# Altium project 300mGal.PrjPcb
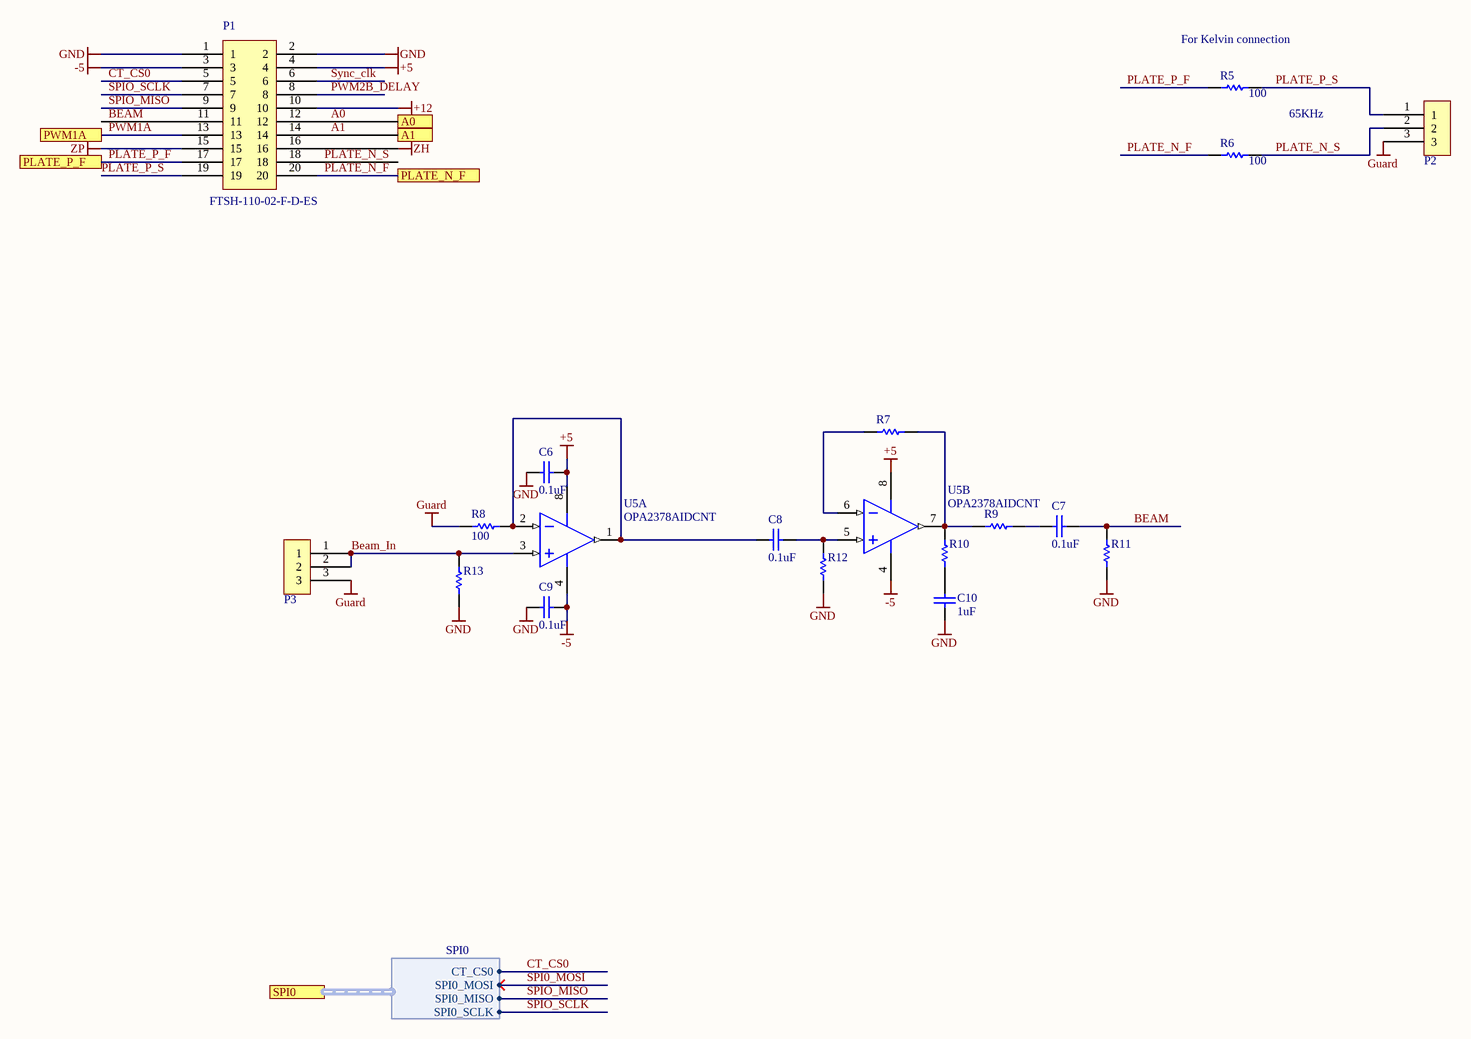
[diagram p0: Beam_Amp.SchDoc]
3 sheets, 41 parts. Net scope: flat (ports and power ports of the same name join across sheets).
Board file: LM-CT-001.PcbDoc
Sheets:
  Beam_Amp.SchDoc
  ZP_Force_Plates.SchDoc
  ADC.SchDoc

## Sheet Beam_Amp.SchDoc
size Tabloid

### Parts
C6  0.1uF  [CAPC0402(1005)60_L]
C7  0.1uF  [CAPC0402(1005)60_L]
C8  0.1uF  [CAPC0402(1005)60_L]
C9  0.1uF  [CAPC0402(1005)60_L]
C10  1uF  [CAPC0402(1005)60_L]
P1  FTSH-110-02-F-D-ES  [FTSH-110-02-F-D-ES]
P2  Triax_Conn  [Triax_Conn]  (value not drawn)
P3  Triax_Conn  [Triax_Conn]  (value not drawn)
R5  100  [RESC0805(2012)_L]
R6  100  [RESC0805(2012)_L]
R7  (no value)  [RESC0402(1005)_M]
R8  100  [RESC0402(1005)_M]
R9  (no value)  [RESC0402(1005)_M]
R10  (no value)  [RESC0402(1005)_M]
R11  (no value)  [RESC0402(1005)_M]
R12  (no value)  [RESC0402(1005)_M]
R13  (no value)  [RESC0402(1005)_M]
U5  OPA2378AIDCNT  [DCN0008A_M]  (parts A,B of 2)

### Ports
A0, A1, PLATE_N_F, PLATE_P_F, PWM1A, SPI0 (harness SPI0)

### Harnesses
SPI0: CT_CS0, SPI0_MOSI, SPI0_MISO, SPI0_SCLK

### Nets
+5: C6.2 P1.4 U5.8(V+)
+12: P1.10
-5: C9.2 P1.3 U5.4(V-)
GND: C6.1 C9.1 C10.1 P1.1 P1.2 R11.2 R12.2 R13.1
Guard: P2.3 P3.3 R8.2
ZH: P1.16
ZP: P1.15
A0: P1.12 ; port A0
A1: P1.14 ; port A1
BEAM: C7.2 P1.11 R11.1
Beam_In: P3.1 P3.2 R13.2 U5.3(IN_A+)
CT_CS0: P1.5 ; port SPI0.CT_CS0
PLATE_N_F: P1.20 R6.2 ; port PLATE_N_F
PLATE_N_S: P1.18 P2.2 R6.1
PLATE_P_F: P1.17 R5.2 ; port PLATE_P_F
PLATE_P_S: P1.19 P2.1 R5.1
PWM1A: P1.13 ; port PWM1A
PWM2B_DELAY: P1.8
SPI0_MOSI: port SPI0.SPI0_MOSI
SPIO_MISO: P1.9 ; port SPI0.SPI0_MISO
SPIO_SCLK: P1.7 ; port SPI0.SPI0_SCLK
Sync_clk: P1.6
NetC7_1: C7.1 R9.1
NetC8_1: C8.1 R8.1 U5.1(OUT_A) U5.2(IN_A-)
NetC8_2: C8.2 R12.1 U5.5(IN_B+)
NetC10_2: C10.2 R10.2
NetR7_1: R7.1 R9.2 R10.1 U5.7(OUT_B)
NetR7_2: R7.2 U5.6(IN_B-)

### Notes on the sheet
- (near R5) For Kelvin connection
- 65KHz
- Title
- Size:
- Date:
- Tabloid
- Number:
- Time:
- Revision:
- Sheet
- of
- ZLS Corporation
- 7801 North Lamar Blvd.
- Suite E-184
- Austin, Texas 78752  USA
- (512) 453-0288
- File:

### Library data of the parts
C6-C10 = CMP-1034-00252-1: CAP CER 0.1UF 10V X7R 0402; Manufacturer: Murata Electronics North America; Manufacturer Part Number: GRM155R71A104KA01D; Tolerance: ±10%; Supplier 1: Digi-Key; Supplier Part Number 1: 490-6321-1-ND; RoHS: RoHS Compliant; Category: Capacitors; Stock 1: 2920395; Pricing 1: 1=0.1, 10=0.014, 100=0.0063, 500=0.00446, 1000=0.00351, 2500=0.00319, 5000=0.00293 (USD); Packaging: Cut Tape (CT); Part Status: Active; Voltage - Rated: 10V; Temperature Coefficient: X7R; Operating Temperature: -55°C ~ 125°C; Features: -; Ratings: -; Applications: General Purpose; Mounting Type: Surface Mount, MLCC; Package / Case: 0402 (1005 Metric); Size / Dimension: 0.039" L x 0.020" W (1.00mm x 0.50mm); Height - Seated (Max): -; Thickness (Max): 0.022" (0.55mm); Lead Spacing: -; ComponentLink1URL: http://www.murata.com/~/media/webrenewal/support/library/catalog/products/capacitor/mlcc/c02e.ashx?la=en-us; ComponentLink1Description: http://www.murata.com/~/media/webrenewal/support/library/catalog/products/capacitor/mlcc/c02e.ashx?la=en-us
R5 R6 = CMP-1013-00215-1: RES SMD 100 OHM JUMPER 1/8W 0805
R7-R13 = CMP-1011-00463-1
U5 = CMP-0272-01124-3: Low-Noise, 900 kHz, RRIO, Precision Operational Amplifier, Zero-Drift Series, 2.2 to 5.5 V, -40 to 125 degC, 8-pin SOP (DCN8), Green (RoHS & no Sb/Br); Manufacturer: Texas Instruments; Number of Channels: 2; Offset Drift(Typ)(uV/C): 0.25; Total Supply Voltage(Min)(+5V is 5, +/-5V is 10): 2.2; Vn at 1kHz(Typ)(nV/rtHz): 20; Iq per channel(Max)(mA): 0.15; Total Supply Voltage(Max)(+5V is 5, +/-5V is 10): 5.5; Sub Family: Low Offset Voltage Amplifier (<=500uV), Low Power Amp (<=500uA), Low Supply Voltage Amplifier (<=2.7V), Precision Amplifier, Zero Drift Precision Amplifier; IIB(Max)(pA): 550; Vio (25C)(Max)(mV): 0.07; CMRR(Min)(dB): 100; Slew Rate(Typ)(V/us): 0.4; PartNumber: OPA2378AIDCNT; DatasheetVersion: SBOS417D; ComponentLink2Description: Datasheet; ComponentLink3URL: http://www.ti.com/lit/ml/mpds099c/mpds099c.pdf; ComponentLink2URL: http://www.ti.com/general/docs/lit/getliterature.tsp?genericPartNumber=OPA2378&fileType=pdf; PackageReference: DCN0008A; PackageDescription: 8-Pin Plastic Small Outline, Body 1.6 x 2.9 mm, Pitch 0.65 mm; Code_JEDEC: MO-178; PackageVersion: 4202106/D, 11/2009; ComponentLink3Description: Package Specification; Eco-Plan: Green (RoHS & no Sb/Br); ComponentLink1Description: Manufacturer URL; Mounting Technology: Surface Mount; ComponentLink1URL: http://www.ti.com/; PartId: 1

## Sheet ZP_Force_Plates.SchDoc
size Tabloid; Organization: Altium Limited; Address1: L3, 12a Rodborough Rd; Address2: Frenchs Forest; Address3: NSW; Address4: Australia 2086
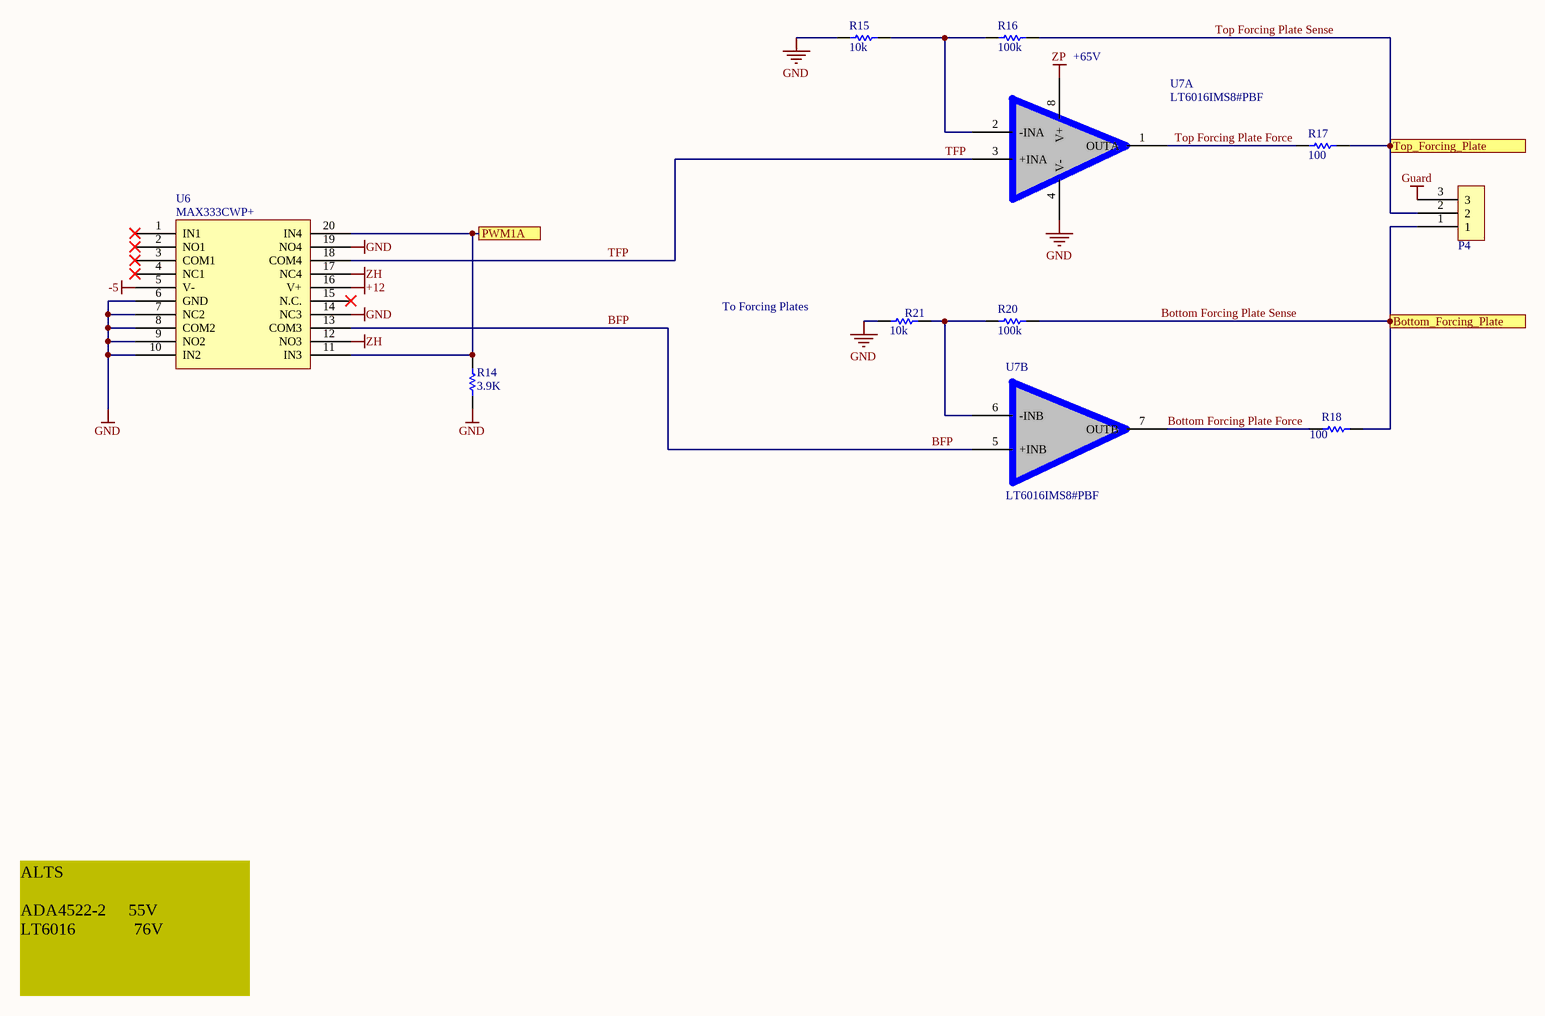
[diagram p1: ZP_Force_Plates.SchDoc]

### Parts
P4  Triax_Conn  [Triax_Conn]  (value not drawn)
R14  3.9K  [RESC0402(1005)_M]
R15  10k  [RESC0402(1005)_M]
R16  100k  [RESC0402(1005)_M]
R17  100  [RESC0402(1005)_M]
R18  100  [RESC0402(1005)_M]
R20  100k  [RESC0402(1005)_M]
R21  10k  [RESC0402(1005)_M]
U6  MAX333CWP+  [TSOP65P640X90-20N]
U7  Supplier Part Number 1: LT6016IMS8#PBF  [LT6016]  (hidden comment: LT6016)  (parts A,B of 2)

### Ports
Bottom_Forcing_Plate, PWM1A, Top_Forcing_Plate

### Nets
+12: U6.16(V+)
-5: U6.5(V-)
GND: R14.1 R15.1 R21.1 U6.6(GND) U6.7(NC2) U6.8(COM2) U6.9(NO2) U6.10(IN2) U6.14(NC3) U6.19(NO4) U7.4(V-)
Guard: P4.3
ZH: U6.12(NO3) U6.17(NC4)
ZP: U7.8(V+)
BFP: U6.13(COM3) U7.5(+INB)
Bottom Forcing Plate Force: R18.1 U7.7(OUTB)
Bottom Forcing Plate Sense: P4.1 R18.2 R20.2 ; port Bottom_Forcing_Plate
PWM1A: R14.2 U6.11(IN3) U6.20(IN4) ; port PWM1A
TFP: U6.18(COM4) U7.3(+INA)
Top Forcing Plate Force: R17.1 U7.1(OUTA)
Top Forcing Plate Sense: P4.2 R16.2 R17.2 ; port Top_Forcing_Plate
NetR15_2: R15.2 R16.1 U7.2(-INA)
NetR20_1: R20.1 R21.2 U7.6(-INB)

Not connected (* = marked no-connect by the designer): U6 1(IN1)* 2(NO1)* 3(COM1)* 4(NC1)* 15(N.C.)*

### Notes on the sheet
- +65V
- To Forcing Plates
- ALTS
  ADA4522-2     55V
  LT6016             76V
- Title
- Size:
- Date:
- Tabloid
- Number:
- Time:
- Revision:
- Sheet
- of
- ZLS Corporation
- 7801 North Lamar Blvd.
- Suite E-184
- Austin, Texas 78752  USA
- (512) 453-0288
- File:

### Library data of the parts
R14-R18 R20 R21 = CMP-1011-00463-1
U6 = MAX333CWP+: IC SWITCH QUAD SPDT 20TSSOP; Manufacturer: Maxim; Manufacturer Part Number: MAX333AEUP+; Max Supply Voltage: 30V; Min Supply Voltage: 10V; Min Dual Supply Voltage: 4.5V; Max Dual Supply Voltage: 20V; On-State Resistance: 35R; Operating Supply Current: 1uA; Supply Type: Single,Dual; Max Power Dissipation: 559mW; Turn-On Delay Time: 175ns; Turn-Off Delay Time: 145ns; Max Supply Current: 250uA; Number of Bits: 4; Dual Supply Voltage: 15V; Supplier 1: Mouser; Supplier Part Number 1: 700-MAX333AEUP; Stock 1: 664; Pricing 1: 1=6.77, 10=6.43, 50=5.8, 100=5.8, 1000=5.62, 10000=5.62 (USD); Case/Package: TSSOP; Number of Pins: 20; Weight: 0.006737oz; Min Operating Temperature: -40°C; Max Operating Temperature: 85°C; Packaging: Rail/Tube; Package Quantity: 74; Throw Configuration: SPDT; Number of Channels: 4; Length: 6.6mm; Height: 0.95mm; Width: 4.5mm; Radiation Hardening: No; Lead Free: Lead Free; REACH SVHC: Unknown; ComponentLink1URL: https://datasheet.ciiva.com/2978/max333a-2978850.pdf; ComponentLink1Description: https://datasheet.ciiva.com/2978/max333a-2978850.pdf; ComponentLink2URL: https://datasheet.ciiva.com/30478/0900766b81253c85-30478260.pdf; ComponentLink2Description: https://datasheet.ciiva.com/30478/0900766b81253c85-30478260.pdf; ComponentLink3URL: https://datasheet.ciiva.com/1674/max333a-1674617.pdf; ComponentLink3Description: https://datasheet.ciiva.com/1674/max333a-1674617.pdf; ComponentLink4URL: https://datasheet.ciiva.com/26825/max333aeup-26825546.pdf; ComponentLink4Description: https://datasheet.ciiva.com/26825/max333aeup-26825546.pdf
U7 = LT6016: IC OPAMP GP 3.3MHZ RRO 8MSOP; Supplier 1: Arrow

## Sheet ADC.SchDoc
size Tabloid
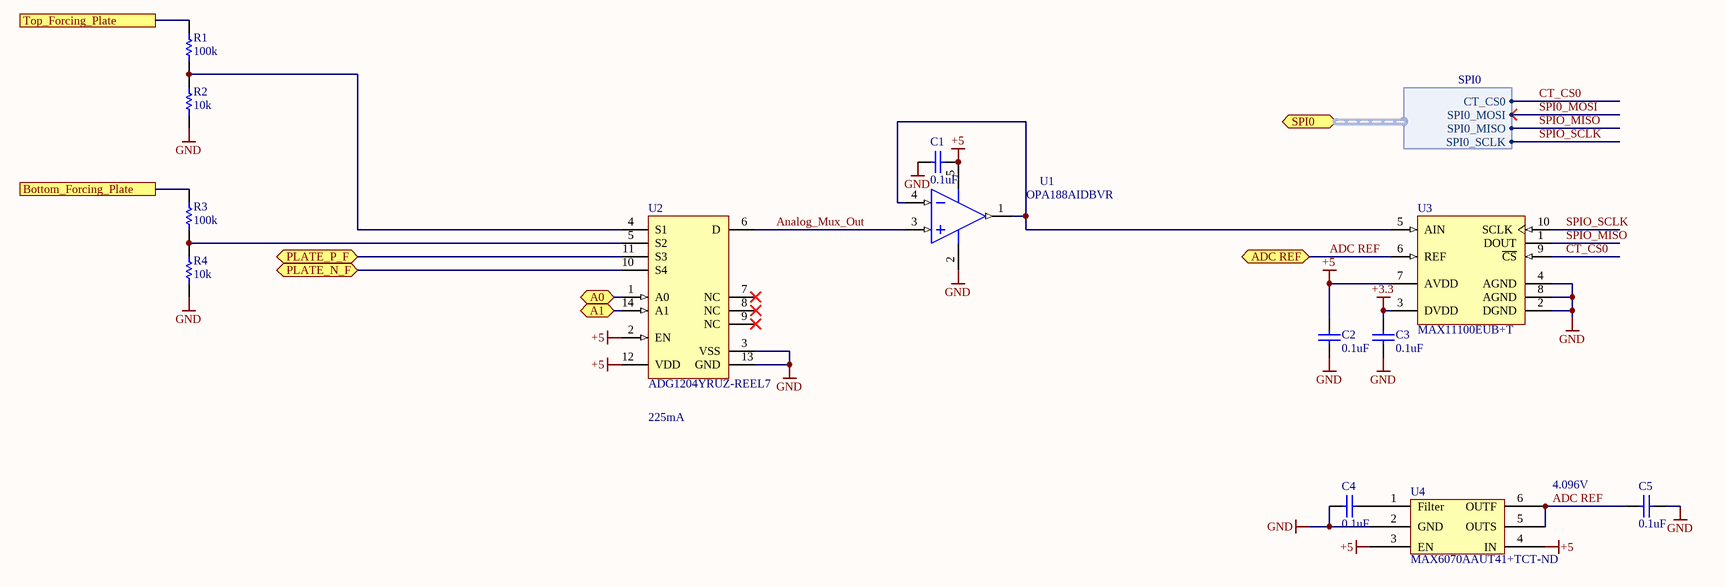
[diagram p2: ADC.SchDoc]

### Parts
C1  0.1uF  [CAPC0402(1005)60_L]
C2  0.1uF  [CAPC0402(1005)60_L]
C3  0.1uF  [CAPC0402(1005)60_L]
C4  0.1uF  [CAPC0402(1005)60_L]
C5  0.1uF  [CAPC0402(1005)60_L]
R1  100k  [RESC0402(1005)_M]
R2  10k  [RESC0402(1005)_M]
R3  100k  [RESC0402(1005)_M]
R4  10k  [RESC0402(1005)_M]
U1  OPA188AIDBVR  [DBV0005A_M]
U2  ADG1204YRUZ-REEL7  [ADI-RU-14_L]
U3  MAX11100EUB+T  [U10+2_L]
U4  Supplier Part Number 1: MAX6070AAUT41+TCT-ND  [SOT95P280X445-6N]  (hidden comment: MAX6070AAUT41+T)

### Ports
A0, A1, ADC REF, Bottom_Forcing_Plate, PLATE_N_F, PLATE_P_F, SPI0 (harness SPI0), Top_Forcing_Plate

### Harnesses
SPI0: CT_CS0, SPI0_MOSI, SPI0_MISO, SPI0_SCLK

### Nets
+3.3: C3.2 U3.3(DVDD)
+5: C1.2 C2.2 U1.5(V+) U2.2(EN) U2.12(VDD) U3.7(AVDD) U4.3(EN) U4.4(IN)
GND: C1.1 C2.1 C3.1 C4.1 C5.2 R2.2 R4.2 U1.2(V-) U2.3(VSS) U2.13(GND) U3.2(DGND) U3.4(AGND) U3.8(AGND) U4.2(GND)
A0: U2.1(A0) ; port A0
A1: U2.14(A1) ; port A1
ADC REF: C5.1 U3.6(REF) U4.5(OUTS) U4.6(OUTF) ; port ADC REF
Analog_Mux_Out: U1.3(IN+) U2.6(D)
Bottom Forcing Plate Sense: R3.1 ; port Bottom_Forcing_Plate
CT_CS0: U3.9(~{CS}) ; port SPI0.CT_CS0
PLATE_N_F: U2.10(S4) ; port PLATE_N_F
PLATE_P_F: U2.11(S3) ; port PLATE_P_F
SPI0_MOSI: port SPI0.SPI0_MOSI
SPIO_MISO: U3.1(DOUT) ; port SPI0.SPI0_MISO
SPIO_SCLK: U3.10(SCLK) ; port SPI0.SPI0_SCLK
Top Forcing Plate Sense: R1.1 ; port Top_Forcing_Plate
NetC4_2: C4.2 U4.1(Filter)
NetR1_2: R1.2 R2.1 U2.4(S1)
NetR3_2: R3.2 R4.1 U2.5(S2)
NetU1_1: U1.1(OUT) U1.4(IN-) U3.5(AIN)

Not connected (* = marked no-connect by the designer): U2 7(NC)* 8(NC)* 9(NC)*

### Notes on the sheet
- (near U2) 225mA
- 4.096V
- Title
- Size:
- Date:
- Tabloid
- Number:
- Time:
- Revision:
- Sheet
- of
- ZLS Corporation
- 7801 North Lamar Blvd.
- Suite E-184
- Austin, Texas 78752  USA
- (512) 453-0288
- File:

### Library data of the parts
C1-C5 = CMP-1034-00252-1: as C6 on sheet Beam_Amp; Supplier 1: Digi-Key; Supplier Part Number 1: 490-6321-1-ND; RoHS: RoHS Compliant; Category: Capacitors; Stock 1: 2920395; Pricing 1: 1=0.1, 10=0.014, 100=0.0063, 500=0.00446, 1000=0.00351, 2500=0.00319, 5000=0.00293 (USD); Packaging: Cut Tape (CT); Part Status: Active; Voltage - Rated: 10V; Temperature Coefficient: X7R; Operating Temperature: -55°C ~ 125°C; Features: -; Ratings: -; Applications: General Purpose; Mounting Type: Surface Mount, MLCC; Package / Case: 0402 (1005 Metric); Size / Dimension: 0.039" L x 0.020" W (1.00mm x 0.50mm); Height - Seated (Max): -; Thickness (Max): 0.022" (0.55mm); Lead Spacing: -; ComponentLink1URL: http://www.murata.com/~/media/webrenewal/support/library/catalog/products/capacitor/mlcc/c02e.ashx?la=en-us; ComponentLink1Description: http://www.murata.com/~/media/webrenewal/support/library/catalog/products/capacitor/mlcc/c02e.ashx?la=en-us
R1-R4 = CMP-1011-00463-1
U1 = CMP-0809-00005-2: Precision, Low Noise, Rail-to-Rail Output, Zero-Drift Operational Amplifier, 4 to 36 V, -40 to 125 degC, 5-pin SOT23 (DBV5), Green (RoHS & no Sb/Br); Manufacturer: Texas Instruments; Unity Gain Bandwidth Product: 2MHz; Max Supply Voltage: 36V; Min Supply Voltage: 4V; Min Dual Supply Voltage: 2V; Max Dual Supply Voltage: 18V; Nominal Supply Current: 510uA; Common Mode Rejection Ratio: 120dB; Number of Channels: 1; Slew Rate: 0.8V/µs; Input Bias Current: 160pA; Input Offset Voltage (Vos): 6uV; Operating Supply Current: 450uA; Output Current per Channel: 18mA; Voltage Gain: 136dB; Input Voltage Noise Density: 8.8nV/sqrt Hz; Power Supply Rejection Ratio (PSRR): 142dB; Supplier 1: Arrow; Supplier Part Number 1: OPA188AIDBVR; Manufacturer Part Number: OPA188AIDBVR; Stock 1: 95; Pricing 1: 1=2.1871, 10=1.943, 25=1.9086, 100=1.5565, 250=1.5371, 500=1.3168, 1000=1.2243 (USD); Case/Package: SOT-23-5; Number of Pins: 5; Contact Plating: Nickel,Gold; Min Operating Temperature: -40°C; Max Operating Temperature: 125°C; Packaging: Tape and Reel; Package Quantity: 3000; Nominal Gain Bandwidth Product: 2MHz; Number of Circuits: 1; Gain Bandwidth Product: 2MHz; Number of Elements: 1; Lead Free: Lead Free; ComponentLink1URL: https://datasheet.ciiva.com/24017/opa188-372986-24017253.pdf; ComponentLink1Description: https://datasheet.ciiva.com/24017/opa188-372986-24017253.pdf; ComponentLink2URL: https://datasheet.ciiva.com/18622/opa188-18622375.pdf; ComponentLink2Description: https://datasheet.ciiva.com/18622/opa188-18622375.pdf
U2 = CMP-0793-00109-1: Low Capacitance, Low Charge Injection, +/-15 V / +12 V, 4:1 iCMOS Multiplexer, 120 Ohm Ron, 14-pin SOP (RU-14), Reel; Manufacturer: Maxim Integrated; Manufacturer Part Number: MAX11100EUB+; Number of Bits: 16; Sampling Rate (Per Second): 200k; Number of Inputs: 1; Input Type: Single Ended; Data Interface: SPI; Configuration: S/H-ADC; Ratio - S/H:ADC: 1:1; Architecture: SAR; Reference Type: External; Voltage - Supply, Analog: 5V; Voltage - Supply, Digital: 2.7 V ~ 5.25 V; Supplier 1: Digi-Key; Supplier Part Number 1: MAX11100EUB+-ND; RoHS: RoHS Compliant; Category: Integrated Circuits (ICs); Stock 1: 927; Pricing 1: 1=5.98, 10=5.855 (USD); Packaging: Tube; Part Status: Active; Features: -; Operating Temperature: -40°C ~ 85°C; Package / Case: 10-TFSOP, 10-MSOP (0.118", 3.00mm Width); Supplier Device Package: 10-uMAX; Base Part Number: MAX11100; ComponentLink1URL: https://datasheets.maximintegrated.com/en/ds/MAX11100.pdf; ComponentLink1Description: https://datasheets.maximintegrated.com/en/ds/MAX11100.pdf
U3 = CMP-0249-00017-1: 16-Bit, +5V, 200ksps ADC with 10uA Shutdown, 10-Pin uMAX, -40°C to +85°C, Pb-Free, Tape and Reel; Manufacturer: Maxim Integrated; Number of Bits: 16; Sampling Rate (Per Second): 200k; Number of Inputs: 1; Input Type: Single Ended; Data Interface: SPI; Configuration: S/H-ADC; Ratio - S/H:ADC: 1:1; Architecture: SAR; Reference Type: External; Voltage - Supply, Analog: 5V; Voltage - Supply, Digital: 2.7 V ~ 5.25 V; Supplier 1: Digi-Key; Supplier Part Number 1: MAX11100EUB+-ND; Manufacturer Part Number: MAX11100EUB+; RoHS: RoHS Compliant; Category: Integrated Circuits (ICs); Stock 1: 927; Pricing 1: 1=5.98, 10=5.855 (USD); Packaging: Tube; Part Status: Active; Features: -; Operating Temperature: -40°C ~ 85°C; Package / Case: 10-TFSOP, 10-MSOP (0.118", 3.00mm Width); Supplier Device Package: 10-uMAX; Base Part Number: MAX11100; ComponentLink1URL: https://datasheets.maximintegrated.com/en/ds/MAX11100.pdf; ComponentLink1Description: https://datasheets.maximintegrated.com/en/ds/MAX11100.pdf
U4 = MAX6070AAUT41+T: IC VREF SERIES 4.096V SOT23; Manufacturer: Maxim Integrated; Output Type: Fixed; Tolerance: ±0.04%; Temperature Coefficient: 6ppm/°C; Noise - 0.1Hz to 10Hz: 9.6µVp-p; Noise - 10Hz to 10kHz: 9µVrms; Voltage - Input: 4.3 V ~ 5.5 V; Current - Supply: 350µA; Supplier 1: Digi-Key; Manufacturer Part Number: MAX6070AAUT41+T; RoHS: RoHS Compliant; Category: Integrated Circuits (ICs); Stock 1: 2623; Pricing 1: 1=3.41, 10=3.213, 25=2.5704, 50=2.4418, 100=2.2491, 250=2.13344, 500=2.05634 (USD); Packaging: Cut Tape (CT); Part Status: Active; Reference Type: Series; Voltage - Output (Min/Fixed): 4.096V; Operating Temperature: -40°C ~ 125°C (TA); Mounting Type: Surface Mount; Package / Case: SOT-23-6; Supplier Device Package: SOT-23-6; ComponentLink1URL: https://datasheets.maximintegrated.com/en/ds/MAX6070-MAX6071.pdf; ComponentLink1Description: https://datasheets.maximintegrated.com/en/ds/MAX6070-MAX6071.pdf

## Nets that join several sheets
+5: Beam_Amp (C6.2 P1.4 U5.8), ADC (8 pins)
+12: Beam_Amp (P1.10), ZP_Force_Plates (U6.16)
-5: Beam_Amp (C9.2 P1.3 U5.4), ZP_Force_Plates (U6.5)
GND: Beam_Amp (8 pins), ZP_Force_Plates (11 pins), ADC (14 pins)
Guard: Beam_Amp (P2.3 P3.3 R8.2), ZP_Force_Plates (P4.3)
ZH: Beam_Amp (P1.16), ZP_Force_Plates (U6.12 U6.17)
ZP: Beam_Amp (P1.15), ZP_Force_Plates (U7.8)
A0: Beam_Amp (P1.12), ADC (U2.1)
A1: Beam_Amp (P1.14), ADC (U2.14)
Bottom Forcing Plate Sense: ZP_Force_Plates (P4.1 R18.2 R20.2), ADC (R3.1)
CT_CS0: Beam_Amp (P1.5), ADC (U3.9)
PLATE_N_F: Beam_Amp (P1.20 R6.2), ADC (U2.10)
PLATE_P_F: Beam_Amp (P1.17 R5.2), ADC (U2.11)
PWM1A: Beam_Amp (P1.13), ZP_Force_Plates (R14.2 U6.11 U6.20)
SPIO_MISO: Beam_Amp (P1.9), ADC (U3.1)
SPIO_SCLK: Beam_Amp (P1.7), ADC (U3.10)
Top Forcing Plate Sense: ZP_Force_Plates (P4.2 R16.2 R17.2), ADC (R1.1)